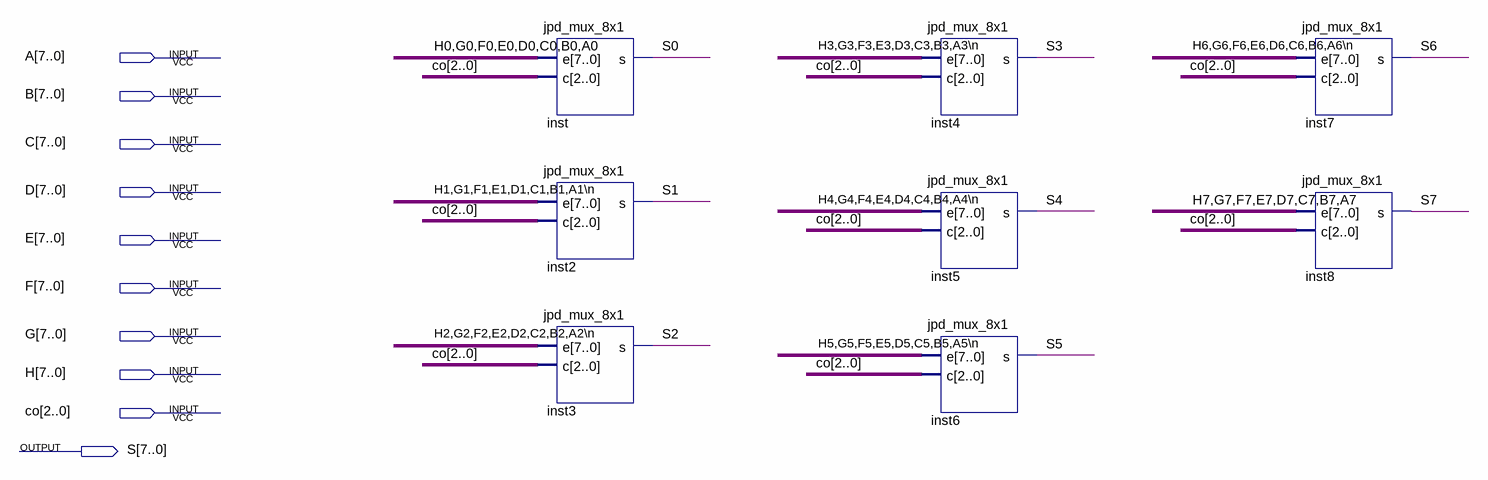
[diagram p0: schematic sheet]
// Quartus schematic jpd_mux_8x1_8bit.bdf as structural Verilog: 8 symbols, 10 pins
module jpd_mux_8x1_8bit (
  input  [7:0] A,
  input  [7:0] B,
  input  [7:0] C,
  input  [7:0] D,
  input  [7:0] E,
  input  [7:0] F,
  input  [7:0] G,
  input  [7:0] H,
  input  [2:0] co,
  output [7:0] S
);

  wire \A1\n , \A2\n , \A3\n , \A4\n , \A5\n , \A6\n ;

  jpd_mux_8x1 inst (.e({H[0], G[0], F[0], E[0], D[0], C[0], B[0], A[0]}), .c(co), .s(S[0]));
  jpd_mux_8x1 inst2 (.e({H[1], G[1], F[1], E[1], D[1], C[1], B[1], \A1\n }), .c(co), .s(S[1]));
  jpd_mux_8x1 inst3 (.e({H[2], G[2], F[2], E[2], D[2], C[2], B[2], \A2\n }), .c(co), .s(S[2]));
  jpd_mux_8x1 inst4 (.e({H[3], G[3], F[3], E[3], D[3], C[3], B[3], \A3\n }), .c(co), .s(S[3]));
  jpd_mux_8x1 inst5 (.e({H[4], G[4], F[4], E[4], D[4], C[4], B[4], \A4\n }), .c(co), .s(S[4]));
  jpd_mux_8x1 inst6 (.e({H[5], G[5], F[5], E[5], D[5], C[5], B[5], \A5\n }), .c(co), .s(S[5]));
  jpd_mux_8x1 inst7 (.e({H[6], G[6], F[6], E[6], D[6], C[6], B[6], \A6\n }), .c(co), .s(S[6]));
  jpd_mux_8x1 inst8 (.e({H[7], G[7], F[7], E[7], D[7], C[7], B[7], A[7]}), .c(co), .s(S[7]));
endmodule
